# Altium schematic sheet 07 SYS.SchDoc
size 420 x 297 mm
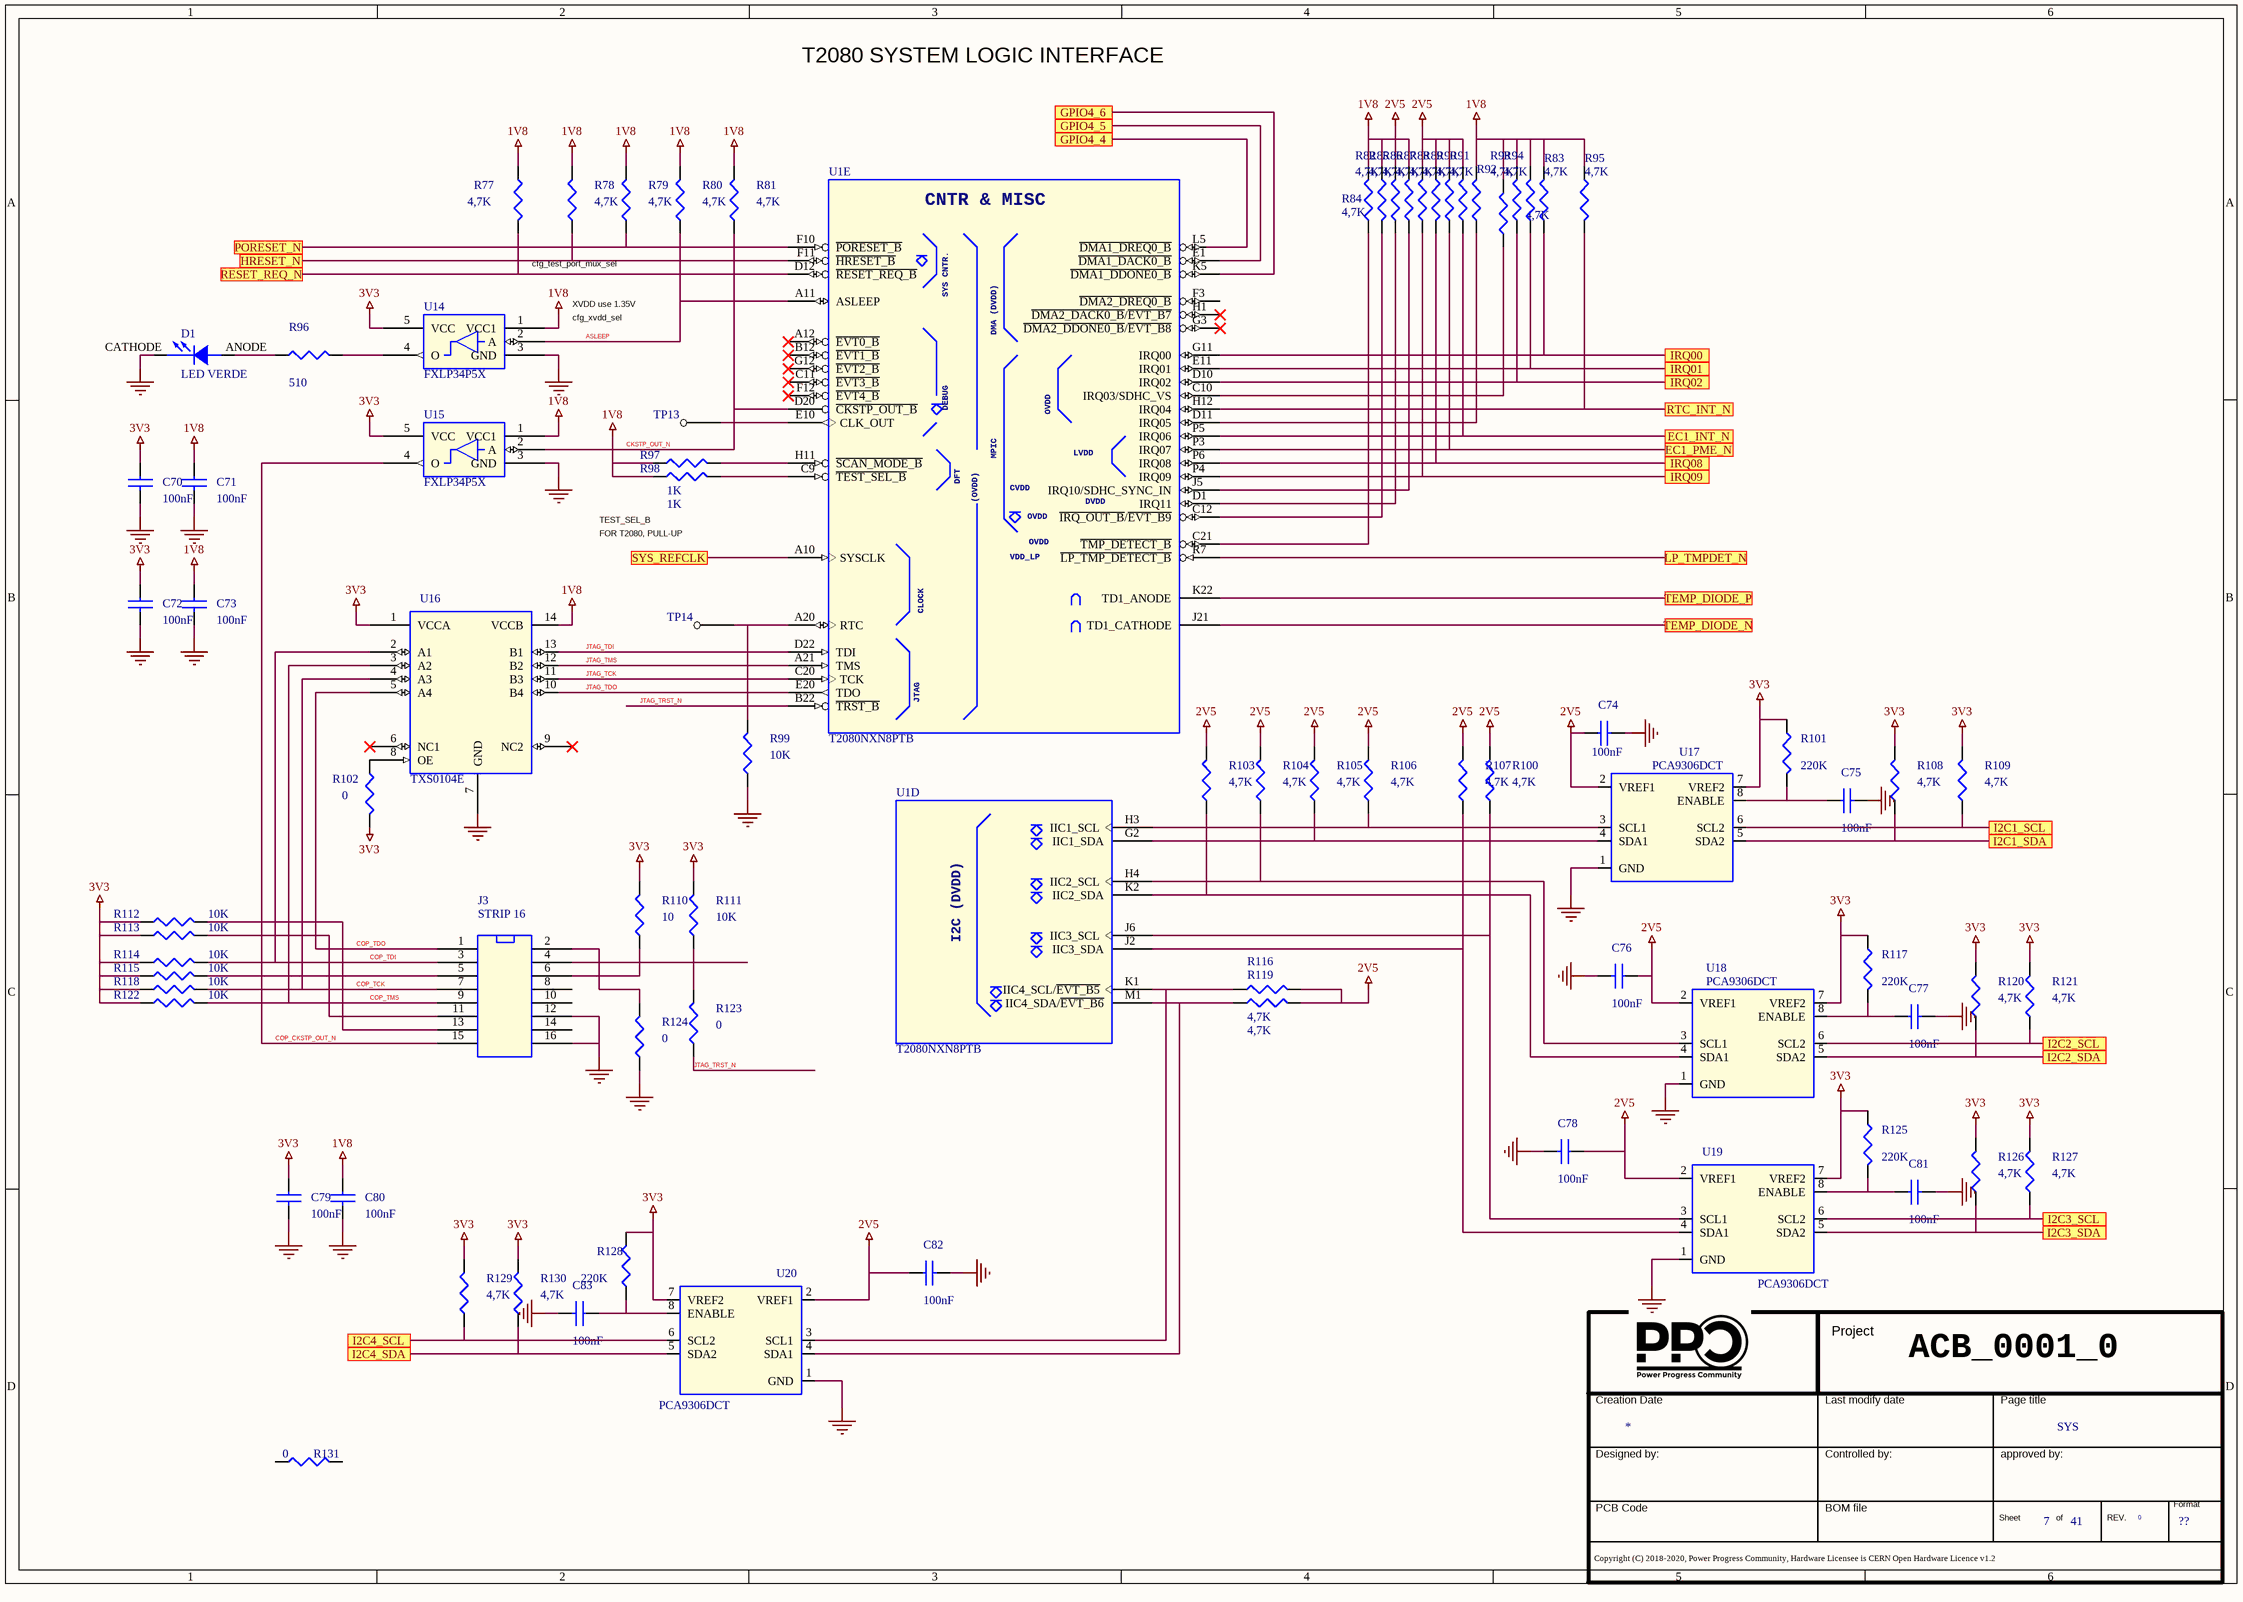
[diagram p0: 07 SYS.SchDoc]

## Parts
*  Doc: SYS  Page Count: 41  Page Number: 7  Page Size: ??  RevCode: 0  (hidden comment: Title_block_PPC)  (graphical)
C70  100nF  [SMD_0402]
C71  100nF  [SMD_0402]
C72  100nF  [SMD_0402]
C73  100nF  [SMD_0402]
C74  100nF  [SMD_0402]
C75  100nF  [SMD_0402]
C76  100nF  [SMD_0402]
C77  100nF  [SMD_0402]
C78  100nF  [SMD_0402]
C79  100nF  [SMD_0402]
C80  100nF  [SMD_0402]
C81  100nF  [SMD_0402]
C82  100nF  [SMD_0402]
C83  100nF  [SMD_0402]
D1  LED VERDE  [led_0603]
J3  STRIP 16  [SMD_2X50_P=0.635mm]
R77  4,7K  [SMD_0402]
R78  4,7K  [SMD_0402]
R79  4,7K  [SMD_0402]
R80  4,7K  [SMD_0402]
R81  4,7K  [SMD_0402]
R82  4,7K  [SMD_0402]
R83  4,7K  [SMD_0402]
R84  4,7K  [SMD_0402]
R85  4,7K  [SMD_0402]
R86  4,7K  [SMD_0402]
R87  4,7K  [SMD_0402]
R88  4,7K  [SMD_0402]
R89  4,7K  [SMD_0402]
R90  4,7K  [SMD_0402]
R91  4,7K  [SMD_0402]
R92  4,7K  [SMD_0402]
R93  4,7K  [SMD_0402]
R94  4,7K  [SMD_0402]
R95  4,7K  [SMD_0402]
R96  510  [SMD_0402]
R97  1K  [SMD_0402]
R98  1K  [SMD_0402]
R99  10K  [SMD_0402]
R100  4,7K  [SMD_0402]
R101  220K  [SMD_0402]
R102  0  [SMD_0402]
R103  4,7K  [SMD_0402]
R104  4,7K  [SMD_0402]
R105  4,7K  [SMD_0402]
R106  4,7K  [SMD_0402]
R107  4,7K  [SMD_0402]
R108  4,7K  [SMD_0402]
R109  4,7K  [SMD_0402]
R110  10  [SMD_0402]
R111  10K  [SMD_0402]
R112  10K  [SMD_0402]
R113  10K  [SMD_0402]
R114  10K  [SMD_0402]
R115  10K  [SMD_0402]
R116  4,7K  [SMD_0402]
R117  220K  [SMD_0402]
R118  10K  [SMD_0402]
R119  4,7K  [SMD_0402]
R120  4,7K  [SMD_0402]
R121  4,7K  [SMD_0402]
R122  10K  [SMD_0402]
R123  0  [SMD_0402]
R124  0  [SMD_0402]
R125  220K  [SMD_0402]
R126  4,7K  [SMD_0402]
R127  4,7K  [SMD_0402]
R128  220K  [SMD_0402]
R129  4,7K  [SMD_0402]
R130  4,7K  [SMD_0402]
R131  0  [SMD_0402]
TP13  tp  [tp]  (value not drawn)
TP14  tp  [tp]  (value not drawn)
U1  T2080NXN8PTB  [bga]  (parts D,E of 14)
U14  FXLP34P5X  [sc70_5]
U15  FXLP34P5X  [sc70_5]
U16  TXS0104E  [TSSOP14]
U17  PCA9306DCT  [8-SSOP]
U18  PCA9306DCT  [8-SSOP]
U19  PCA9306DCT  [8-SSOP]
U20  PCA9306DCT  [8-SSOP]

## Ports
EC1_INT_N, EC1_PME_N, GPIO4_4, GPIO4_5, GPIO4_6, HRESET_N, I2C1_SCL, I2C1_SDA, I2C2_SCL, I2C2_SDA, I2C3_SCL, I2C3_SDA, I2C4_SCL, I2C4_SDA, IRQ00, IRQ01, IRQ02, IRQ08, IRQ09, LP_TMPDET_N, PORESET_N, RESET_REQ_N, RTC_INT_N, SYS_REFCLK, TEMP_DIODE_N, TEMP_DIODE_P

## Nets
1V8: C71.1 C73.1 C80.1 R77.2 R78.2 R79.2 R80.2 R81.2 R82.1 R83.2 R84.2 R86.2 R91.2 R92.2 R93.2 R94.2 R95.1 R97.1 R98.1 U14.1(VCC1) U15.1(VCC1) U16.14(VCCB)
2V5: C74.1 C76.1 C78.1 C82.1 R85.2 R87.2 R88.1 R89.2 R90.2 R100.2 R103.2 R104.2 R105.2 R106.2 R107.1 R116.2 R119.2 U17.2(VREF1) U18.2(VREF1) U19.2(VREF1) U20.2(VREF1)
3V3: C70.1 C72.1 C79.1 R101.1 R102.1 R108.2 R109.2 R110.2 R111.2 R112.1 R113.1 R114.1 R115.1 R117.1 R118.1 R120.2 R121.2 R122.1 R125.1 R126.2 R127.2 R128.1 R129.1 R130.1 U14.5(VCC) U15.5(VCC) U16.1(VCCA) U17.7(VREF2) U18.7(VREF2) U19.7(VREF2) U20.7(VREF2)
GND: C70.2 C71.2 C72.2 C73.2 C74.2 C75.2 C76.2 C77.2 C78.2 C79.2 C80.2 C81.2 C82.2 C83.2 D1.CATHODE J3.12 J3.16 R99.1 R124.1 U14.3(GND) U15.3(GND) U16.7(GND) U17.1(GND) U18.1(GND) U19.1(GND) U20.1(GND)
ASLEEP: R80.1 U1.A11(ASLEEP) U14.2(A)
CKSTP_OUT_N: R81.1 U1.D20(~{CKSTP_OUT_B}) U15.2(A)
COP_CKSTP_OUT_N: J3.15 U15.4(O)
COP_TCK: J3.7 R118.2 U16.4(A3)
COP_TDI: J3.3 R114.2 U16.2(A1)
COP_TDO: J3.1 U16.5(A4)
COP_TMS: J3.9 R122.2 U16.3(A2)
EC1_INT_N: R90.1 U1.P5(IRQ06) ; port EC1_INT_N
EC1_PME_N: R89.1 U1.P3(IRQ07) ; port EC1_PME_N
GPIO4_4: U1.L5(~{DMA1_DREQ0_B}) ; port GPIO4_4
GPIO4_5: U1.E1(~{DMA1_DACK0_B}) ; port GPIO4_5
GPIO4_6: U1.K5(~{DMA1_DDONE0_B}) ; port GPIO4_6
HRESET_N: R78.1 U1.F11(~{HRESET_B}) ; port HRESET_N
I2C1_SCL: R109.1 U17.6(SCL2) ; port I2C1_SCL
I2C1_SDA: R108.1 U17.5(SDA2) ; port I2C1_SDA
I2C2_SCL: R121.1 U18.6(SCL2) ; port I2C2_SCL
I2C2_SDA: R120.1 U18.5(SDA2) ; port I2C2_SDA
I2C3_SCL: R127.1 U19.6(SCL2) ; port I2C3_SCL
I2C3_SDA: R126.1 U19.5(SDA2) ; port I2C3_SDA
I2C4_SCL: R129.2 U20.6(SCL2) ; port I2C4_SCL
I2C4_SDA: R130.2 U20.5(SDA2) ; port I2C4_SDA
IRQ00: R83.1 U1.G11(IRQ00) ; port IRQ00
IRQ01: R94.1 U1.E11(IRQ01) ; port IRQ01
IRQ02: R93.1 U1.D10(IRQ02) ; port IRQ02
IRQ08: R88.2 U1.P6(IRQ08) ; port IRQ08
IRQ09: R87.1 U1.P4(IRQ09) ; port IRQ09
JTAG_TCK: U1.C20(TCK) U16.11(B3)
JTAG_TDI: U1.D22(TDI) U16.13(B1)
JTAG_TDO: U1.E20(TDO) U16.10(B4)
JTAG_TMS: U1.A21(TMS) U16.12(B2)
JTAG_TRST_N: R123.1 U1.B22(~{TRST_B})
LP_TMPDET_N: U1.R7(~{LP_TMP_DETECT_B}) ; port LP_TMPDET_N
PORESET_N: R79.1 U1.F10(~{PORESET_B}) ; port PORESET_N
RESET_REQ_N: R77.1 U1.D12(~{RESET_REQ_B}) ; port RESET_REQ_N
RTC_INT_N: R95.2 U1.H12(IRQ04) ; port RTC_INT_N
SYS_REFCLK: U1.A10(SYSCLK) ; port SYS_REFCLK
TEMP_DIODE_N: U1.J21(TD1_CATHODE) ; port TEMP_DIODE_N
TEMP_DIODE_P: U1.K22(TD1_ANODE) ; port TEMP_DIODE_P
NetC75_1: C75.1 R101.2 U17.8(ENABLE)
NetC77_1: C77.1 R117.2 U18.8(ENABLE)
NetC81_1: C81.1 R125.2 U19.8(ENABLE)
NetC83_1: C83.1 R128.2 U20.8(ENABLE)
NetD1_ANODE: D1.ANODE R96.1
NetJ3_2: J3.2 R124.2
NetJ3_4: J3.4 R111.1 R123.2
NetJ3_5: J3.5 J3.11 R113.2 R115.2
NetJ3_6: J3.6 R110.1
NetJ3_13: J3.13 R112.2
NetR82_2: R82.2 U1.C12(~{IRQ_OUT_B}/~{EVT_B9})
NetR84_1: R84.1 U1.C21(~{TMP_DETECT_B})
NetR85_1: R85.1 U1.D1(IRQ11)
NetR86_1: R86.1 U1.J5(IRQ10/SDHC_SYNC_IN)
NetR91_1: R91.1 U1.D11(IRQ05)
NetR92_1: R92.1 U1.C10(IRQ03/SDHC_VS)
NetR96_2: R96.2 U14.4(O)
NetR97_2: R97.2 U1.H11(~{SCAN_MODE_B})
NetR98_2: R98.2 U1.C9(~{TEST_SEL_B})
NetR99_2: R99.2 TP14.1(TP) U1.A20(RTC)
NetR100_1: R100.1 U1.J6(IIC3_SCL) U19.3(SCL1)
NetR102_2: R102.2 U16.8(OE)
NetR103_1: R103.1 U1.K2(IIC2_SDA) U18.4(SDA1)
NetR104_1: R104.1 U1.H4(IIC2_SCL) U18.3(SCL1)
NetR105_1: R105.1 U1.G2(IIC1_SDA) U17.4(SDA1)
NetR106_1: R106.1 U1.H3(IIC1_SCL) U17.3(SCL1)
NetR107_2: R107.2 U1.J2(IIC3_SDA) U19.4(SDA1)
NetR116_1: R116.1 U1.K1(IIC4_SCL/~{EVT_B5}) U20.3(SCL1)
NetR119_1: R119.1 U1.M1(IIC4_SDA/~{EVT_B6}) U20.4(SDA1)
NetTP13_1: TP13.1(TP) U1.E10(CLK_OUT)

Not connected (* = marked no-connect by the designer): J3 8 10 14; R131 1 2; U1 A12(~{EVT0_B})* B12(~{EVT1_B})* C11(~{EVT3_B})* F3(~{DMA2_DREQ0_B}) F12(~{EVT4_B})* G3(~{DMA2_DDONE0_B}/~{EVT_B8})* G12(~{EVT2_B})* H1(~{DMA2_DACK0_B}/~{EVT_B7})*; U16 6(NC1)* 9(NC2)*

## Notes on the sheet
- T2080 SYSTEM LOGIC INTERFACE
- cfg_test_port_mux_sel
- cfg_xvdd_sel
- XVDD use 1.35V
- TEST_SEL_B
- FOR T2080, PULL-UP
- ACB_0001_0
- (in symbol T2080, part D) I2C (DVDD)
- (in symbol T2080, part E) CNTR & MISC; SYS CNTR.; DMA (DVDD); DEBUG; OVDD; MPIC; LVDD; DFT; CVDD; (OVDD); DVDD; CLOCK; JTAG
- (in symbol Title_block_PPC) Project; Creation Date; Last modify date; Page title; Designed by:; Controlled by:; approved by:; Format; PCB Code; BOM file; Sheet; of; REV.; Copyright (C) 2018-2020, Power Progress Community, Hardware Licensee is CERN Open Hardware Licence v1.2

## Library data of the parts
* = Title_block_PPC: Title: T2080PCIe; Schematic Page Count: 45; Schematic Page Number: 8; Author: MICETEK; Page Create Date: March  8, 1995; Page Title: ?; Page Modify Date: *
C70-C73 = CAP NP_Dup2: COND.CER. 100NF 50V 0402 X7R SMD; Manufacturer Part Number 1: CGA2B3X7R1H104M050BD; Manufacturer 1: TDK; Part Number: PASSIVE_24; RSM: RC0402; PCB Footprint: SMD_0402; Part Type: Capacitors\Ceramic\SMD\0402
C74-C83 = CAP NP_Dup2: COND.CER. 100NF 50V 0402 X7R SMD; Part Number: PASSIVE_24; Manufacturer 1: TDK; Manufacturer Part Number 1: CGA2B3X7R1H104M050BD; RSM: RC0402; Part Type: Capacitors\Ceramic\SMD\0402; PCB Footprint: SMD_0402
D1 = LED_1: LED CHIPLED VERDE 40mcd 570nm; Manufacturer Part Number 1: 598-8070-107F; Manufacturer 1: DIALIGHT; Part Number: DISCRETE_31; PCB Footprint: SMD_0603; RSM: LED0603-AK; Distributor 1: MOUSER(645-598-8070-107F); Part Type: Diodes\LED; TYPE: LED
J3 = HEADER_8X2: STRIP MASCH.2x8P CS.p=2.0mm SMT; PART NUMBER: CONNECTORS_517; Manufacturer Part Number 1: TMMH-108-01-L-DV; Manufacturer 1: Samtec; RSM: SAMTEC-TMMH-108-01-L-DV-16; PCB Footprint: 8X2P=2.0mm SMT; Distributor 1: FARNELL(2024017); Part Type: Strip\Terminal
R77-R94 R100 R103-R109 R116 R119-R121 R126 R127 R129 R130 = R_Dup5: RESIS.CHIP 4,7K 5% 0402 SMD; Part Number: PASSIVE_861; Manufacturer 1: ROYAL OHM; RSM: RC0402; Part Type: Resistors\Fixed\SMD\0402\5%; Manufacturer Part Number 1: RESIS.CHIP 4,7K 5% 0402 SMD; PCB Footprint: SMD_0402
R95 = R_Dup5: RESIS.CHIP 4,7K 5% 0402 SMD; Manufacturer 1: ROYAL OHM; Part Number: PASSIVE_861; RSM: RC0402; Manufacturer Part Number 1: RESIS.CHIP 4,7K 5% 0402 SMD; Part Type: Resistors\Fixed\SMD\0402\5%; PCB Footprint: SMD_0402
R96 = R_Dup5: RESIS.CHIP 510R 1% 0402 SMD; Part Number: PASSIVE_749; Manufacturer 1: ROYAL OHM; RSM: RC0402; Part Type: Resistors\Fixed\SMD\0402\1%; Manufacturer Part Number 1: RESIS.CHIP 510R 1% 0402 SMD; PCB Footprint: SMD_0402
R97 R98 = R_Dup5: RESIS.CHIP 1K 1% 0402 SMD; Part Number: PASSIVE_628; Manufacturer 1: ROYAL OHM; RSM: RC0402; PCB Footprint: SMD_0402; Part Type: Resistors\Fixed\SMD\0402\1%; Manufacturer Part Number 1: RESIS.CHIP 1K 1% 0402 SMD
R99 R111-R113 R118 R122 = R_Dup5: RESIS.CHIP 10K 1% 0402 SMD; Part Number: PASSIVE_584; Manufacturer 1: ROYAL OHM; RSM: RC0402; PCB Footprint: SMD_0402; Part Type: Resistors\Fixed\SMD\0402\1%; Manufacturer Part Number 1: RESIS.CHIP 10K 1% 0402 SMD
R101 R117 R128 = R_Dup5: RESIS.CHIP 220K 5% 0402 SMD; Manufacturer 1: ROYAL OHM; Part Number: PASSIVE_842; RSM: RC0402; Distributor 1: CAMEL ELETTRONICA SRL  #; Manufacturer Part Number 1: RESIS.CHIP 220K 5% 0402 SMD; Part Type: Resistors\Fixed\SMD\0402\5%; PCB Footprint: SMD_0402
R102 R123 R124 = R_Dup5: RESIS.CHIP 0R 5% 0402 SMD; Part Number: PASSIVE_805; Manufacturer 1: ROYAL OHM; RSM: RC0402; Part Type: Resistors\Fixed\SMD\0402\5%; Manufacturer Part Number 1: RESIS.CHIP 0R 5% 0402 SMD; PCB Footprint: SMD_0402
R110 = R_Dup5: RESIS.CHIP 10R 5% 0402 SMD; Part Number: PASSIVE_811; Manufacturer 1: ROYAL OHM; RSM: RC0402; Part Type: Resistors\Fixed\SMD\0402\5%; Manufacturer Part Number 1: RESIS.CHIP 10R 5% 0402 SMD; PCB Footprint: SMD_0402
R114 R115 = R_Dup5: RESIS.CHIP 10K 1% 0402 SMD; Manufacturer 1: ROYAL OHM; Part Number: PASSIVE_584; RSM: RC0402; PCB Footprint: SMD_0402; Manufacturer Part Number 1: RESIS.CHIP 10K 1% 0402 SMD; Part Type: Resistors\Fixed\SMD\0402\1%
R125 = R_Dup5: RESIS.CHIP 220K 5% 0402 SMD; Part Number: PASSIVE_842; Manufacturer 1: ROYAL OHM; RSM: RC0402; Part Type: Resistors\Fixed\SMD\0402\5%; Manufacturer Part Number 1: RESIS.CHIP 220K 5% 0402 SMD; Distributor 1: CAMEL ELETTRONICA SRL  #; PCB Footprint: SMD_0402
R131 = R_Dup8: RESIS.CHIP 0R 5% 0402 SMD; Manufacturer 1: ROYAL OHM; Part Number: PASSIVE_805; RSM: RC0402; Distributor 1: CAMEL ELETTRONICA SRL  #; Manufacturer Part Number 1: RESIS.CHIP 0R 5% 0402 SMD; Part Type: Resistors\Fixed\SMD\0402\5%; PCB Footprint: SMD_0402
TP13 TP14 = TP: RSM: AE-TESTPOINT; PCB Footprint: tp
U1 = T2080: QRIQ MPU 1.87GT/s DDR3/3L 4x10GE; Part Number: MICROPROCESSOR_65; Manufacturer 1: NXP; Vendor: Freescale; PCB Footprint: BGA896; RSM: PBGA896-0_8MM-25X25; TYPE: IC; MPN: T2080; Part Type: 32 BIT; Manufacturer Part Number 1: T2080NXN8PTB; Distributor 1: MOUSER(841-T2080NXN8PTB)
U14 U15 = FXLP34P5X: IC TRANSLATOR DUAL 4BIT 16-DQFN; Part Number: LOGIC_360; Manufacturer 1: ON Semi; Manufacturer Part Number 1: FXL4TD245BQX; Vendor: FAIRCHILD; PCB Footprint: sc70-5; RSM: SC-70-5; TYPE: IC; MPN: FXLP34P5X; Part Type: TRANSLATOR\FXL; Distributor 1: DIGIKEY (FXL4TD245BQXCT-ND)
U16 = TXS0104E: BIDIRECTIONAL VOLTAGE-LEVEL TRANSLATOR; Manufacturer Part Number 1: TXS0104EPWR; Manufacturer 1: TEXAS; Part Number: LOGIC_264; RSM: TSSOP-14; Distributor 1: TI.COM; Part Type: TRANSLATOR; PCB Footprint: TSSOP14
U17 U18 U20 = PCA9306DCUT: IC VOLT-LEVEL TRANSLATOR; Manufacturer 1: TEXAS; Part Number: LOGIC_267; RSM: SSOP-8; Distributor 1: DIGIKEY(296-18509-1-ND); Manufacturer Part Number 1: PCA9306DCT; Part Type: TRANSLATOR\I2C; PCB Footprint: 8-SSOP
U19 = PCA9306DCUT: IC VOLT-LEVEL TRANSLATOR; Part Number: LOGIC_267; Manufacturer 1: TEXAS; RSM: SSOP-8; Part Type: TRANSLATOR\I2C; Manufacturer Part Number 1: PCA9306DCT; Distributor 1: DIGIKEY(296-18509-1-ND); PCB Footprint: 8-SSOP